# EAGLE schematic my snescart (EAGLE 7.6.0)
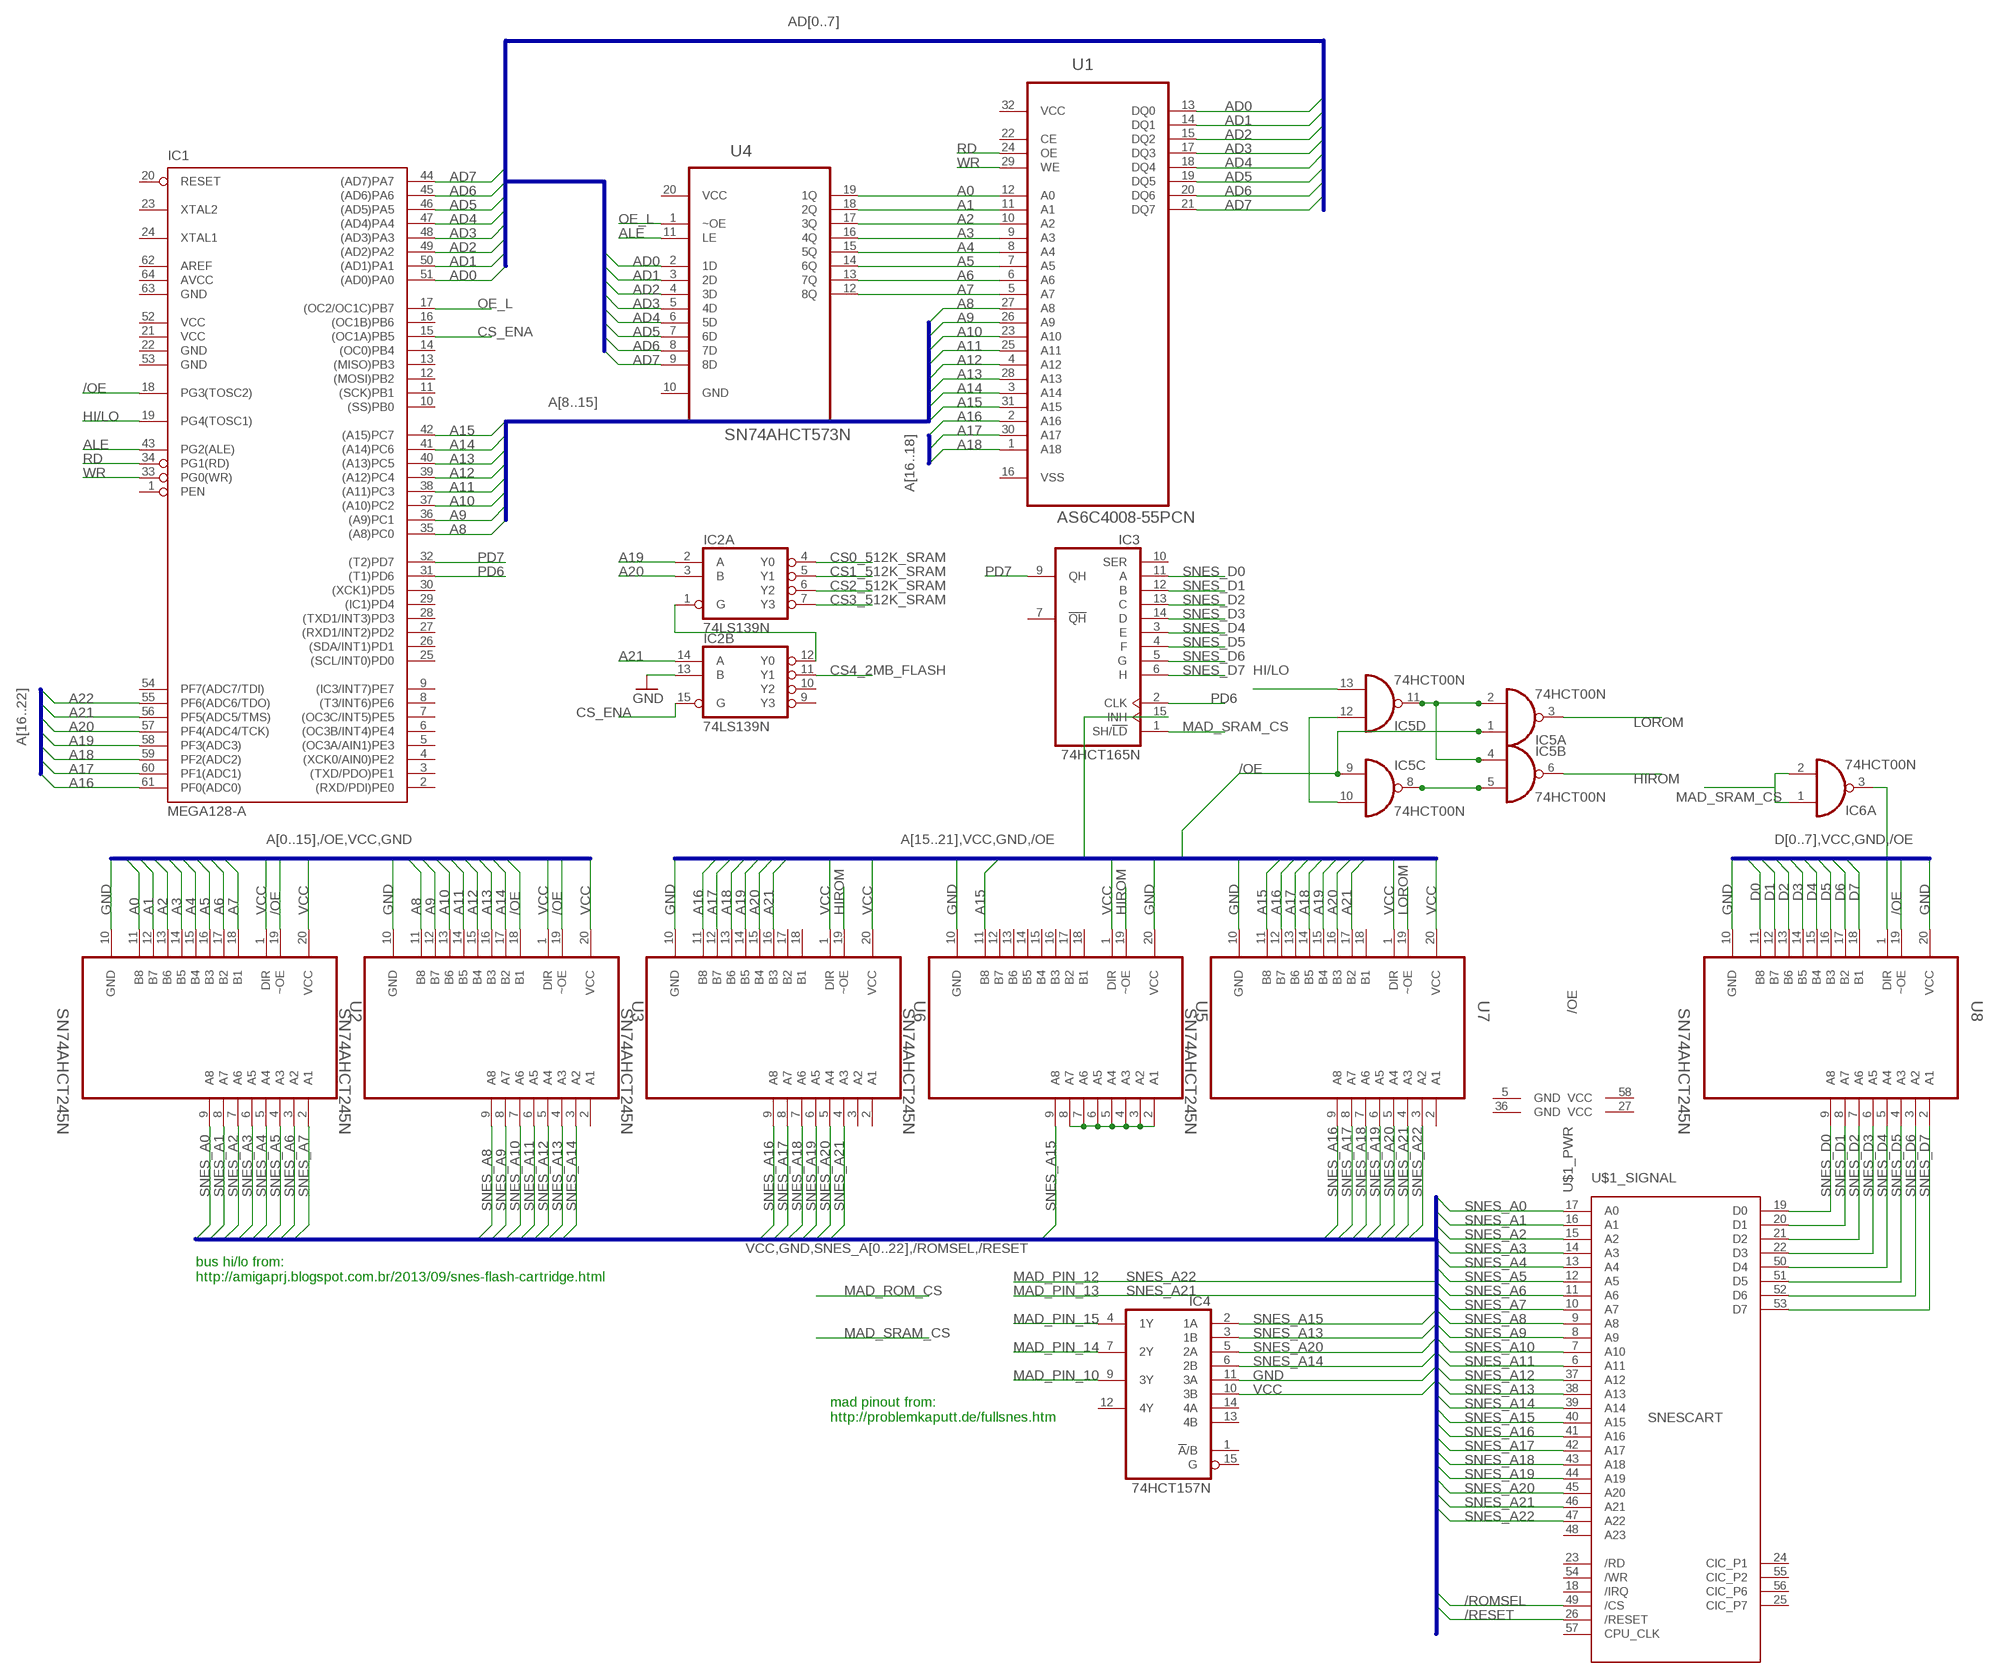
[diagram p0: schematic, sheet 1]

## Parts
IC1  MEGA128-A  [TQFP64]
IC2  74LS139N  [DIL16]
IC3  74HCT165N  [DIL16]
IC4  74HCT157N  [DIL16]
IC5  74HCT00N  [DIL14]
IC6  74HCT00N  [DIL14]
U1  AS6C4008-55PCN  [DIP254P1524X393-32]
U2  SN74AHCT245N  [DIP254P762X508-20]
U3  SN74AHCT245N  [DIP254P762X508-20]
U4  SN74AHCT573N  [DIP254P762X508-20]
U5  SN74AHCT245N  [DIP254P762X508-20]
U6  SN74AHCT245N  [DIP254P762X508-20]
U7  SN74AHCT245N  [DIP254P762X508-20]
U8  SN74AHCT245N  [DIP254P762X508-20]
U$1  SNESCART  [SNESCART]

## Nets
/OE: IC1.18(PG3(TOSC2)) IC5.1(A:I0) IC5.9(C:I0) U2.19(~OE) U3.18(B1) U3.19(~OE) U8.19(~OE)
/RESET: U$1.26(_SIGNAL:/RESET)
/ROMSEL: U$1.49(_SIGNAL:/CS)
A0: U1.12(A0) U2.11(B8) U4.19(1Q)
A1: U1.11(A1) U2.12(B7) U4.18(2Q)
A2: U1.10(A2) U2.13(B6) U4.17(3Q)
A3: U1.9(A3) U2.14(B5) U4.16(4Q)
A4: U1.8(A4) U2.15(B4) U4.15(5Q)
A5: U1.7(A5) U2.16(B3) U4.14(6Q)
A6: U1.6(A6) U2.17(B2) U4.13(7Q)
A7: U1.5(A7) U2.18(B1) U4.12(8Q)
A8: IC1.35((A8)PC0) U1.27(A8) U3.11(B8)
A9: IC1.36((A9)PC1) U1.26(A9) U3.12(B7)
A10: IC1.37((A10)PC2) U1.23(A10) U3.13(B6)
A11: IC1.38((A11)PC3) U1.25(A11) U3.14(B5)
A12: IC1.39((A12)PC4) U1.4(A12) U3.15(B4)
A13: IC1.40((A13)PC5) U1.28(A13) U3.16(B3)
A14: IC1.41((A14)PC6) U1.3(A14) U3.17(B2)
A15: IC1.42((A15)PC7) U1.31(A15) U5.11(B8) U7.11(B8)
A16: IC1.61(PF0(ADC0)) U1.2(A16) U6.11(B8) U7.12(B7)
A17: IC1.60(PF1(ADC1)) U1.30(A17) U6.12(B7) U7.13(B6)
A18: IC1.59(PF2(ADC2)) U1.1(A18) U6.13(B6) U7.14(B5)
A19: IC1.58(PF3(ADC3)) IC2.2(A:A) U6.14(B5) U7.15(B4)
A20: IC1.57(PF4(ADC4/TCK)) IC2.3(A:B) U6.15(B4) U7.16(B3)
A21: IC1.56(PF5(ADC5/TMS)) IC2.14(B:A) U6.16(B3) U7.17(B2)
A22: IC1.55(PF6(ADC6/TDO))
AD0: IC1.51((AD0)PA0) U1.13(DQ0) U4.2(1D)
AD1: IC1.50((AD1)PA1) U1.14(DQ1) U4.3(2D)
AD2: IC1.49((AD2)PA2) U1.15(DQ2) U4.4(3D)
AD3: IC1.48((AD3)PA3) U1.17(DQ3) U4.5(4D)
AD4: IC1.47((AD4)PA4) U1.18(DQ4) U4.6(5D)
AD5: IC1.46((AD5)PA5) U1.19(DQ5) U4.7(6D)
AD6: IC1.45((AD6)PA6) U1.20(DQ6) U4.8(7D)
AD7: IC1.44((AD7)PA7) U1.21(DQ7) U4.9(8D)
ALE: IC1.43(PG2(ALE)) U4.11(LE)
CS0_512K_SRAM: IC2.4(A:Y0)
CS1_512K_SRAM: IC2.5(A:Y1)
CS2_512K_SRAM: IC2.6(A:Y2)
CS3_512K_SRAM: IC2.7(A:Y3)
CS4_2MB_FLASH: IC2.11(B:Y1)
CS_ENA: IC1.15((OC1A)PB5) IC2.15(B:G)
D0: U8.11(B8)
D1: U8.12(B7)
D2: U8.13(B6)
D3: U8.14(B5)
D4: U8.15(B4)
D5: U8.16(B3)
D6: U8.17(B2)
D7: U8.18(B1)
GND: IC2.13(B:B) IC3.15(INH) IC4.11(3A) U2.10(GND) U3.10(GND) U5.10(GND) U5.20(VCC) U6.10(GND) U7.10(GND) U8.10(GND) U8.20(VCC)
HI/LO: IC1.19(PG4(TOSC1)) IC5.13(D:I1)
HIROM: IC5.6(B:O) U5.19(~OE) U6.19(~OE)
LOROM: IC5.3(A:O) U7.19(~OE)
MAD_PIN_10: IC4.9(3Y)
MAD_PIN_14: IC4.7(2Y)
MAD_PIN_15: IC4.4(1Y)
MAD_SRAM_CS: IC3.1(SH/!LD) IC6.1(A:I0) IC6.2(A:I1)
N$1: U5.2(A1) U5.3(A2) U5.4(A3) U5.5(A4) U5.6(A5) U5.7(A6) U5.8(A7)
N$2: IC6.3(A:O) U8.1(DIR)
N$9: IC2.1(A:G) IC2.12(B:Y0)
N$12: IC5.10(C:I1) IC5.12(D:I0)
N$13: IC5.5(B:I1) IC5.8(C:O)
N$14: IC5.2(A:I1) IC5.4(B:I0) IC5.11(D:O)
OE_L: IC1.17((OC2/OC1C)PB7) U4.1(~OE)
PD6: IC1.31((T1)PD6) IC3.2(CLK)
PD7: IC1.32((T2)PD7) IC3.9(QH)
RD: IC1.34(PG1(RD)) U1.24(OE)
SNES_A0: U2.9(A8) U$1.17(_SIGNAL:A0)
SNES_A1: U2.8(A7) U$1.16(_SIGNAL:A1)
SNES_A2: U2.7(A6) U$1.15(_SIGNAL:A2)
SNES_A3: U2.6(A5) U$1.14(_SIGNAL:A3)
SNES_A4: U2.5(A4) U$1.13(_SIGNAL:A4)
SNES_A5: U2.4(A3) U$1.12(_SIGNAL:A5)
SNES_A6: U2.3(A2) U$1.11(_SIGNAL:A6)
SNES_A7: U2.2(A1) U$1.10(_SIGNAL:A7)
SNES_A8: U3.9(A8) U$1.9(_SIGNAL:A8)
SNES_A9: U3.8(A7) U$1.8(_SIGNAL:A9)
SNES_A10: U3.7(A6) U$1.7(_SIGNAL:A10)
SNES_A11: U3.6(A5) U$1.6(_SIGNAL:A11)
SNES_A12: U3.5(A4) U$1.37(_SIGNAL:A12)
SNES_A13: IC4.3(1B) U3.4(A3) U$1.38(_SIGNAL:A13)
SNES_A14: IC4.6(2B) U3.3(A2) U$1.39(_SIGNAL:A14)
SNES_A15: IC4.2(1A) U5.9(A8) U$1.40(_SIGNAL:A15)
SNES_A16: U6.9(A8) U7.9(A8) U$1.41(_SIGNAL:A16)
SNES_A17: U6.8(A7) U7.8(A7) U$1.42(_SIGNAL:A17)
SNES_A18: U6.7(A6) U7.7(A6) U$1.43(_SIGNAL:A18)
SNES_A19: U6.6(A5) U7.6(A5) U$1.44(_SIGNAL:A19)
SNES_A20: IC4.5(2A) U6.5(A4) U7.5(A4) U$1.45(_SIGNAL:A20)
SNES_A21: U6.4(A3) U7.4(A3) U$1.46(_SIGNAL:A21)
SNES_A22: U7.3(A2) U$1.47(_SIGNAL:A22)
SNES_D0: IC3.11(A) U8.9(A8) U$1.19(_SIGNAL:D0)
SNES_D1: IC3.12(B) U8.8(A7) U$1.20(_SIGNAL:D1)
SNES_D2: IC3.13(C) U8.7(A6) U$1.21(_SIGNAL:D2)
SNES_D3: IC3.14(D) U8.6(A5) U$1.22(_SIGNAL:D3)
SNES_D4: IC3.3(E) U8.5(A4) U$1.50(_SIGNAL:D4)
SNES_D5: IC3.4(F) U8.4(A3) U$1.51(_SIGNAL:D5)
SNES_D6: IC3.5(G) U8.3(A2) U$1.52(_SIGNAL:D6)
SNES_D7: IC3.6(H) U8.2(A1) U$1.53(_SIGNAL:D7)
VCC: IC4.10(3B) U2.1(DIR) U2.20(VCC) U3.1(DIR) U3.20(VCC) U5.1(DIR) U6.1(DIR) U6.20(VCC) U7.1(DIR) U7.20(VCC)
WR: IC1.33(PG0(WR)) U1.29(WE)
Unconnected: IC1.1(PEN) IC1.2((RXD/PDI)PE0) IC1.3((TXD/PDO)PE1) IC1.4((XCK0/AIN0)PE2) IC1.5((OC3A/AIN1)PE3) IC1.6((OC3B/INT4)PE4) IC1.7((OC3C/INT5)PE5) IC1.8((T3/INT6)PE6) IC1.9((IC3/INT7)PE7) IC1.10((SS)PB0) IC1.11((SCK)PB1) IC1.12((MOSI)PB2) IC1.13((MISO)PB3) IC1.14((OC0)PB4) IC1.16((OC1B)PB6) IC1.20(RESET) IC1.23(XTAL2) IC1.24(XTAL1) IC1.25((SCL/INT0)PD0) IC1.26((SDA/INT1)PD1) IC1.27((RXD1/INT2)PD2) IC1.28((TXD1/INT3)PD3) IC1.29((IC1)PD4) IC1.30((XCK1)PD5) IC1.54(PF7(ADC7/TDI)) IC1.62(AREF) IC2.9(B:Y3) IC2.10(B:Y2) IC3.7(!QH) IC3.10(SER) IC4.1(!A!/B) IC4.12(4Y) IC4.13(4B) IC4.14(4A) IC4.15(G) IC6.4(B:I0) IC6.5(B:I1) IC6.6(B:O) IC6.8(C:O) IC6.9(C:I0) IC6.10(C:I1) IC6.11(D:O) IC6.12(D:I0) IC6.13(D:I1) U1.16(VSS) U1.22(CE) U3.2(A1) U4.10(GND) U5.12(B7) U5.13(B6) U5.14(B5) U5.15(B4) U5.16(B3) U5.17(B2) U5.18(B1) U6.2(A1) U6.3(A2) U6.17(B2) U6.18(B1) U7.2(A1) U7.18(B1) U$1.18(_SIGNAL:/IRQ) U$1.23(_SIGNAL:/RD) U$1.24(_SIGNAL:CIC_P1) U$1.25(_SIGNAL:CIC_P7) U$1.48(_SIGNAL:A23) U$1.54(_SIGNAL:/WR) U$1.55(_SIGNAL:CIC_P2) U$1.56(_SIGNAL:CIC_P6) U$1.57(_SIGNAL:CPU_CLK)

## Buses
AD[0..7]
A[8..15]
A[16..22]
A[16..18]
A[0..15],/OE,VCC,GND
A[15..21],VCC,GND,/OE
D[0..7],VCC,GND,/OE
VCC,GND,SNES_A[0..22],/ROMSEL,/RESET

## Notes on the sheet
- bus hi/lo from:
  http://amigaprj.blogspot.com.br/2013/09/snes-flash-cartridge.html
- mad pinout from:
  http://problemkaputt.de/fullsnes.htm

## Power pins joined to a net without a drawn wire
AVCC: IC1.64(AVCC)
GND: IC1.22(GND) IC1.53(GND) IC1.63(GND) IC2.8(P:GND) IC3.8(GND) IC4.8(GND) IC5.7(P:GND) IC6.7(P:GND) U$1.5(_PWR:GND) U$1.36(_PWR:GND)
VCC: IC1.21(VCC) IC1.52(VCC) IC2.16(P:VCC) IC3.16(VCC) IC4.16(VCC) IC5.14(P:VCC) IC6.14(P:VCC) U1.32(VCC) U4.20(VCC) U$1.27(_PWR:VCC) U$1.58(_PWR:VCC)

## Library data of the parts
IC1 = atmel:MEGA128: MICROCONTROLLER 128 Kbytes FLASH 4 Kbytes SRAM 4 Kbytes EEPROM DUAL USART 8-channel 10 bit ADC Source: avr.lbr; MPN: ATMEGA128-16AU; OC_FARNELL: 9171118; OC_NEWARK: 95K7364
IC2 = 74xx-us:74*139: Dual 2-line to 4-line DECODER/DEMULTIPLEXER
IC3 = 74xx-eu:74*165: 8-bit parallel load SHIFT REGISTER
IC4 = 74xx-eu:74*157: Quadruple 2-line to 1-line data SELECTOR/MULTIPLEXER
IC5 IC6 = 74xx-eu:74*00: Quad 2-input NAND gate
U1 = Alliance_Memory_By_element14_Batch_1:AS6C4008-55PCN: CMOS SRAM; MPN: AS6C4008-55PCN; OC_FARNELL: 1562900; OC_NEWARK: 94M6217; PACKAGE: DIP-32; SUPPLIER: ALLIANCE MEMORY
U2 U3 U5-U8 = Texas Instruments_By_element14_Batch_1:SN74AHCT245N: octal bus transceivers; MPN: SN74AHCT245N; OC_FARNELL: 1739634; OC_NEWARK: 50R5869; PACKAGE: PDIP-20; SUPPLIER: Texas Instruments
U4 = Texas Instruments_By_element14_Batch_1:SN74AHCT573N: OCTAL D-TYPE TRANSPARENT LATCHES WITH 3-STATE OUTPUT; MPN: SN74AHCT573N; OC_FARNELL: 1740072; OC_NEWARK: 50R5882; PACKAGE: 20-DIP; SUPPLIER: Texas Instruments
U$1 = snescart:SNESCART